# EAGLE design untitled (EAGLE 7.2.0)
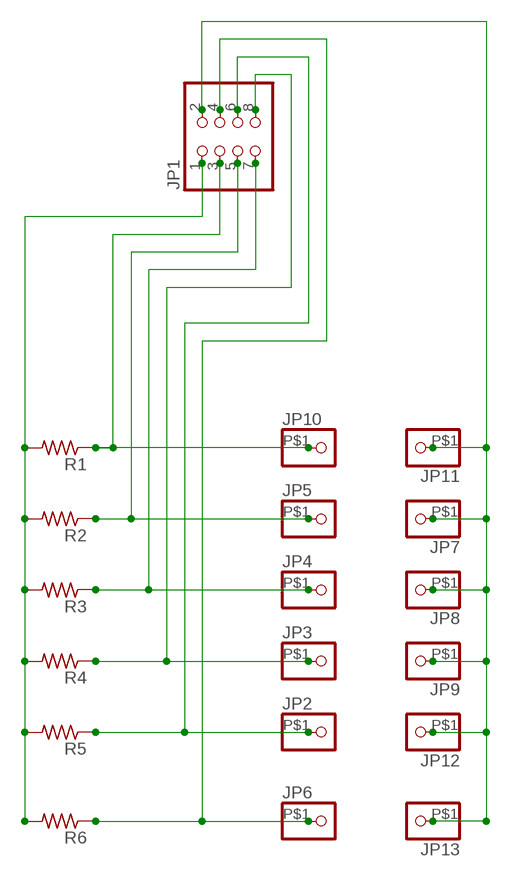
[diagram p0: schematic, sheet 1]

## Parts
JP1  PINHD-2X4  [2X04]
JP2  PINHD-1X1-BIGPOGO  [1X1-BIGPOGO]
JP3  PINHD-1X1-BIGPOGO  [1X1-BIGPOGO]
JP4  PINHD-1X1-BIGPOGO  [1X1-BIGPOGO]
JP5  PINHD-1X1-BIGPOGO  [1X1-BIGPOGO]
JP6  PINHD-1X1-BIGPOGO  [1X1-BIGPOGO]
JP7  PINHD-1X1-BIGPOGO  [1X1-BIGPOGO]
JP8  PINHD-1X1-BIGPOGO  [1X1-BIGPOGO]
JP9  PINHD-1X1-BIGPOGO  [1X1-BIGPOGO]
JP10  PINHD-1X1-BIGPOGO  [1X1-BIGPOGO]
JP11  PINHD-1X1-BIGPOGO  [1X1-BIGPOGO]
JP12  PINHD-1X1-BIGPOGO  [1X1-BIGPOGO]
JP13  PINHD-1X1-BIGPOGO  [1X1-BIGPOGO]
R1  R-US_0204/7  [0204/7]
R2  R-US_0204/7  [0204/7]
R3  R-US_0204/7  [0204/7]
R4  R-US_0204/7  [0204/7]
R5  R-US_0204/7  [0204/7]
R6  R-US_0204/7  [0204/7]

## Nets
N$1: JP1.1 R1.2 R2.2 R3.2 R4.2 R5.2 R6.2
N$2: JP1.3 JP10.P$1 R1.1
N$3: JP1.2 JP7.P$1 JP8.P$1 JP9.P$1 JP11.P$1 JP12.P$1 JP13.P$1
N$4: JP1.5 JP5.P$1 R2.1
N$5: JP1.7 JP4.P$1 R3.1
N$6: JP1.8 JP3.P$1 R4.1
N$7: JP1.6 JP2.P$1 R5.1
N$12: JP1.4 JP6.P$1 R6.1

## Library data of the parts
JP1 = adafruit:PINHD-2X4: PIN HEADER
JP2-JP13 = adafruit:PINHD-1X1: Pin header 1x1 for 0.1" spacing With round pins
R1-R6 = adafruit:R-US_: RESISTOR, American symbol

## Board
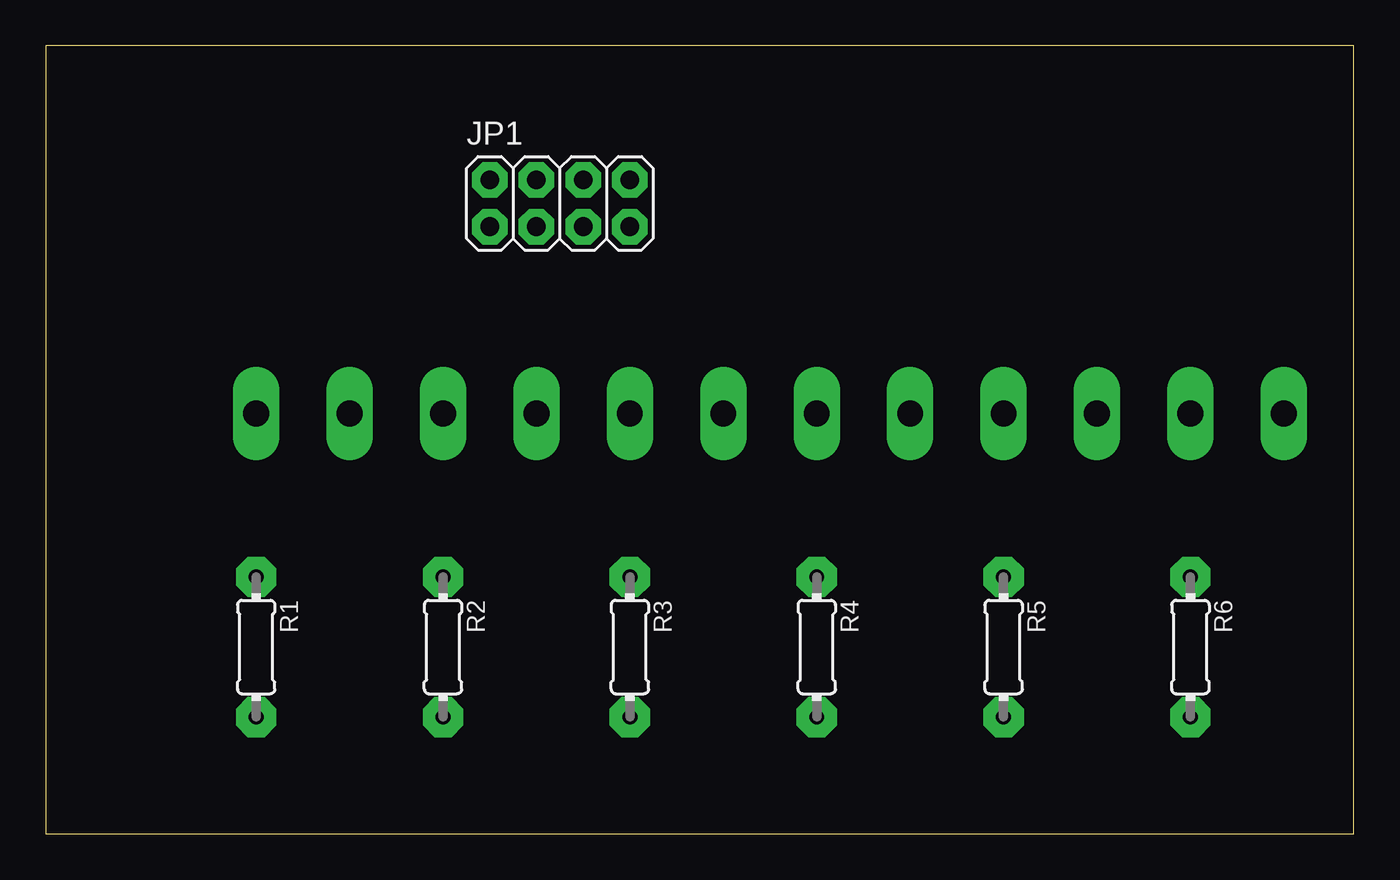
[diagram p1: board, top side]
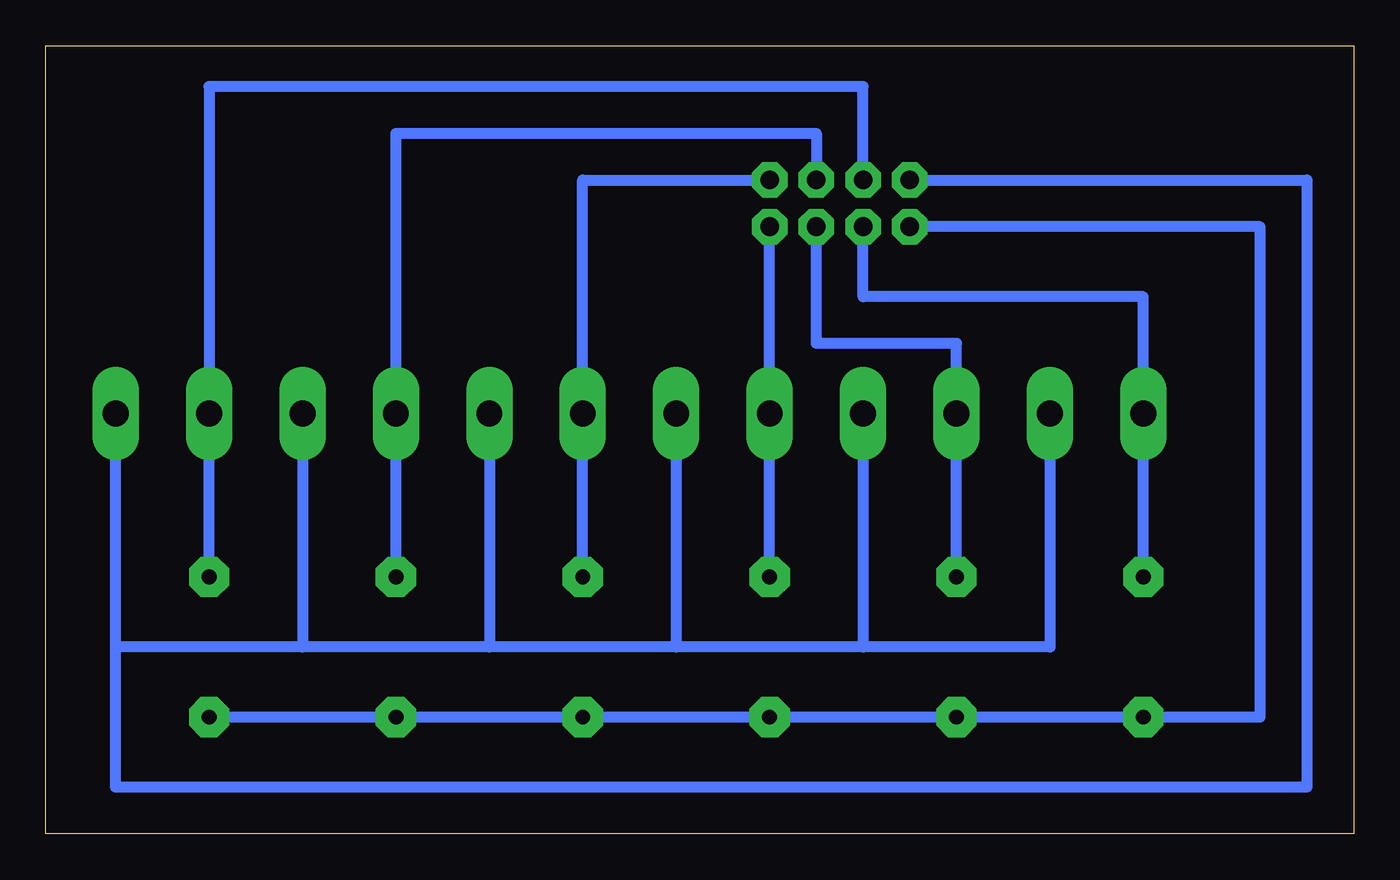
[diagram p2: board, bottom side, seen from below]

Size 71.1 x 42.85 mm. Coordinates in mm from the lower left corner, seen from the top.
Outline: 0,0 71.1,0 71.1,42.85 0,42.85 0,0
Copper layers (1*16): Top 0.035mm / dielectric 1.5mm / Bottom 0.035mm
Design rules "default": minimum track width 10mil, minimum drill 24mil, track to track 8mil, track to pad 8mil, pad to pad 8mil, via to via 8mil, smd to smd 8mil, copper to edge 40mil, drill to drill 8mil, minimum pad ring 10mil, minimum via ring 8mil, stop-mask expansion 4mil, vias tented up to drill 0mil, thermal gap 10mil

### Footprints (pad centres in the part's own frame; a part is rotated, then mirrored left to right if it is on the bottom)
2X04 = drill 1.016 pad 1.93 octagon: 1 -3.81,-1.27; 2 -3.81,1.27; 3 -1.27,-1.27; 4 -1.27,1.27; 5 1.27,-1.27; 6 1.27,1.27; 7 3.81,-1.27; 8 3.81,1.27
1X1-BIGPOGO = drill 1.4 pad 2.54 long: P$1 0,0
0204/7 = drill 0.813 pad 2.184 octagon: 1 -3.81,0; 2 3.81,0

### Placement (x,y rotation side)
JP1  27.94,34.29 0 top
JP2  52.07,22.86 90 top
JP3  41.91,22.86 90 top
JP4  31.75,22.86 90 top
JP5  21.59,22.86 90 top
JP6  62.23,22.86 90 top
JP7  16.51,22.86 270 top
JP8  26.67,22.86 90 top
JP9  57.15,22.86 90 top
JP10  11.43,22.86 270 top
JP11  36.83,22.86 90 top
JP12  46.99,22.86 90 top
JP13  67.31,22.86 90 top
R1  11.43,10.16 270 top
R2  21.59,10.16 270 top
R3  31.75,10.16 270 top
R4  41.91,10.16 270 top
R5  52.07,10.16 270 top
R6  62.23,10.16 270 top

### Tracks (layer width: path | path; a pad name or v marks a point on that pad's centre or on a via)
N$1
  Bottom 0.61: R6.2 R5.2 R4.2 R3.2 R2.2 R1.2 5.08,6.35 5.08,33.02 JP1.1
N$2
  Bottom 0.61: R1.1 JP10.P$1 11.43,29.21 26.67,29.21 JP1.3
N$3
  Bottom 0.61: JP7.P$1 16.51,10.16 26.67,10.16 | 26.67,10.16 36.83,10.16 | 36.83,10.16 46.99,10.16 | 46.99,10.16 57.15,10.16 | 57.15,10.16 67.31,10.16 | 67.31,10.16 JP13.P$1 | JP8.P$1 26.67,10.16 | JP11.P$1 36.83,10.16 | JP12.P$1 46.99,10.16 | JP9.P$1 57.15,10.16 | JP1.2 2.54,35.56 2.54,2.54 67.31,2.54 67.31,10.16
N$4
  Bottom 0.61: R2.1 JP5.P$1 21.59,26.67 29.21,26.67 JP1.5
N$5
  Bottom 0.61: R3.1 JP4.P$1 JP1.7
N$6
  Bottom 0.61: R4.1 JP3.P$1 41.91,35.56 JP1.8
N$7
  Bottom 0.61: R5.1 JP2.P$1 52.07,38.1 29.21,38.1 JP1.6
N$12
  Bottom 0.61: R6.1 JP6.P$1 62.23,40.64 26.67,40.64 JP1.4